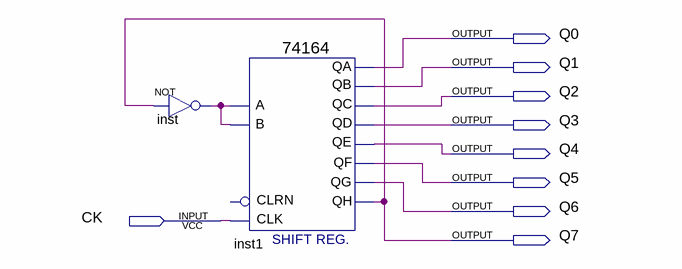
[diagram p0: schematic sheet]
// Quartus schematic 16_MOD_Johnson_74164.bdf as structural Verilog: 2 symbols, 9 pins
module \16_MOD_Johnson_74164  (
  input  CK,
  output Q0,
  output Q1,
  output Q2,
  output Q3,
  output Q4,
  output Q5,
  output Q6,
  output Q7
);

  wire inst_out;

  not inst (inst_out, Q7);
  \74164  inst1 (
    .CLK(CK), .B(inst_out), .A(inst_out), .QD(Q3), .QC(Q2), .QA(Q0), .QF(Q5), .QH(Q7), .QG(Q6), .QE(Q4),
    .QB(Q1));  // open: CLRN
endmodule
